# Altium schematic sheet 5_Band_Equalizer.SchDoc
size A; SheetNumber: 1; SheetTotal: 4
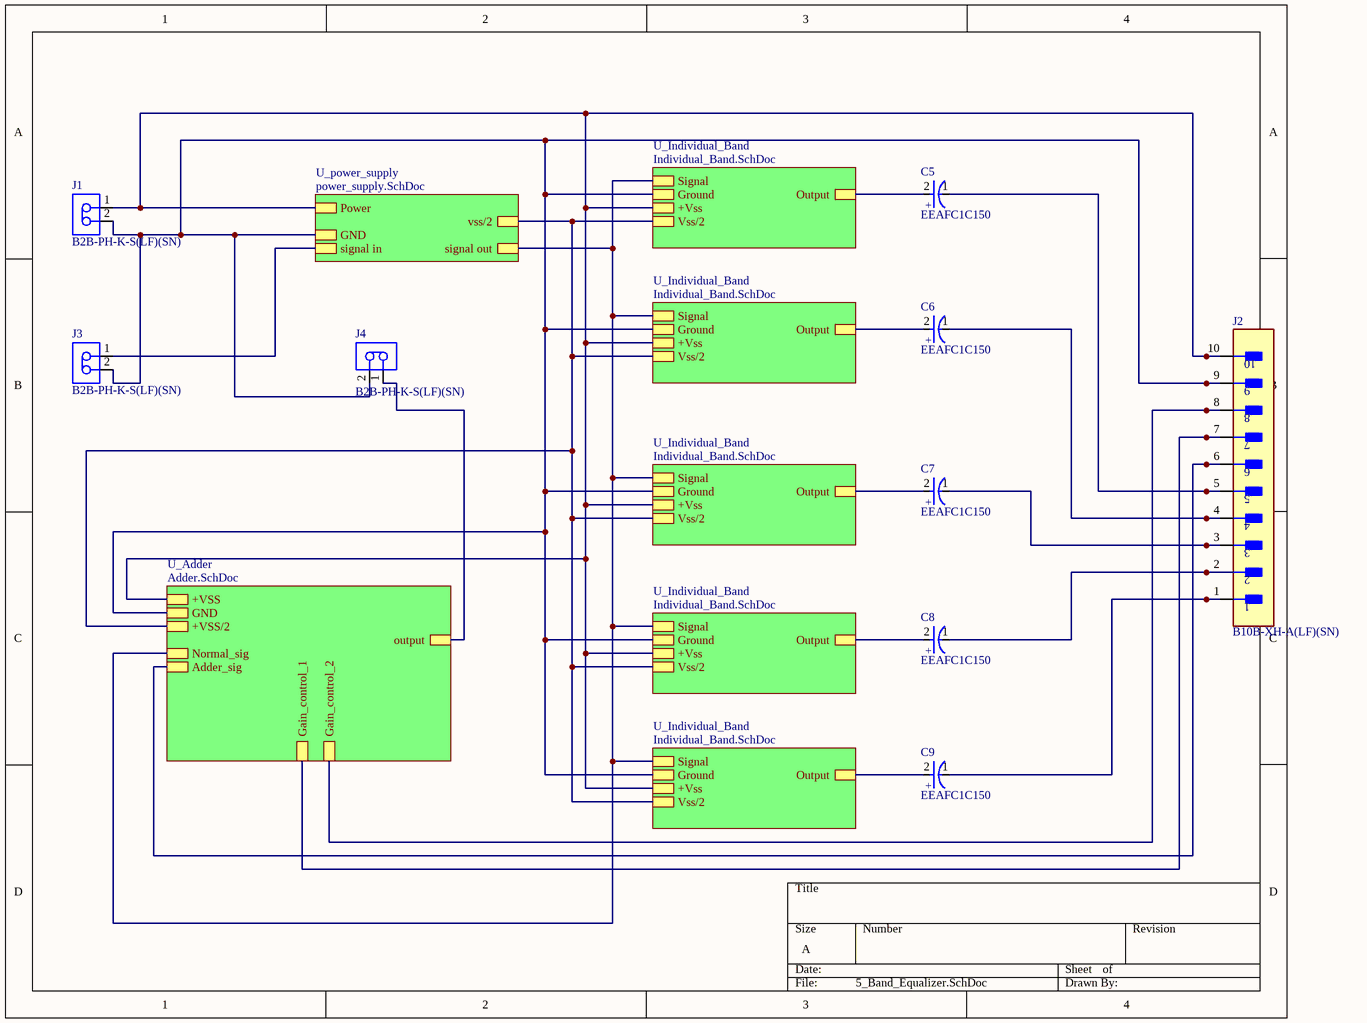
[diagram p0: 5_Band_Equalizer.SchDoc]

## Parts
C5  EEAFC1C150  [FP-RAD-TH-D_4_0_5-L_7_1-F-MFG]
C6  EEAFC1C150  [FP-RAD-TH-D_4_0_5-L_7_1-F-MFG]
C7  EEAFC1C150  [FP-RAD-TH-D_4_0_5-L_7_1-F-MFG]
C8  EEAFC1C150  [FP-RAD-TH-D_4_0_5-L_7_1-F-MFG]
C9  EEAFC1C150  [FP-RAD-TH-D_4_0_5-L_7_1-F-MFG]
J1  B2B-PH-K-S(LF)(SN)  [JST-B2B-PH-K-S_V]
J2  B10B-XH-A(LF)(SN)  [FP-B10B-XH-A_LF_SN-MFG]
J3  B2B-PH-K-S(LF)(SN)  [JST-B2B-PH-K-S_V]
J4  B2B-PH-K-S(LF)(SN)  [JST-B2B-PH-K-S_V]

## Sub-sheets
U_Adder = Adder.SchDoc: +VSS, GND, Gain_control_1, Gain_control_2, Normal_sig, Adder_sig, +VSS/2, output
U_Individual_Band = Individual_Band.SchDoc: Signal, Ground, +Vss, Vss/2, Output
U_Individual_Band = Individual_Band.SchDoc: Signal, Ground, +Vss, Vss/2, Output
U_Individual_Band = Individual_Band.SchDoc: Signal, Ground, +Vss, Vss/2, Output
U_Individual_Band = Individual_Band.SchDoc: Signal, Ground, +Vss, Vss/2, Output
U_Individual_Band = Individual_Band.SchDoc: Signal, Ground, +Vss, Vss/2, Output
U_power_supply = power_supply.SchDoc: GND, Power, vss/2, signal in, signal out

## Nets
NetC5_1: C5.1(C) J2.5
NetC5_2: C5.2(A) ; sheet U_Individual_Band/Output
NetC6_1: C6.1(C) J2.4
NetC6_2: C6.2(A) ; sheet U_Individual_Band/Output
NetC7_1: C7.1(C) J2.3
NetC7_2: C7.2(A) ; sheet U_Individual_Band/Output
NetC8_1: C8.1(C) J2.2
NetC8_2: C8.2(A) ; sheet U_Individual_Band/Output
NetC9_1: C9.1(C) J2.1
NetC9_2: C9.2(A) ; sheet U_Individual_Band/Output
NetJ1_1: J1.1 J2.10 ; sheet U_power_supply/Power, sheet U_Individual_Band/+Vss, sheet U_Individual_Band/+Vss, sheet U_Individual_Band/+Vss, sheet U_Individual_Band/+Vss, sheet U_Individual_Band/+Vss, sheet U_Adder/+VSS
NetJ1_2: J1.2 J2.9 J3.2 J4.2 ; sheet U_power_supply/GND, sheet U_Individual_Band/Ground, sheet U_Individual_Band/Ground, sheet U_Individual_Band/Ground, sheet U_Individual_Band/Ground, sheet U_Individual_Band/Ground, sheet U_Adder/GND
NetJ2_6: J2.6 ; sheet U_Adder/Adder_sig
NetJ2_7: J2.7 ; sheet U_Adder/Gain_control_1
NetJ2_8: J2.8 ; sheet U_Adder/Gain_control_2
NetJ3_1: J3.1 ; sheet U_power_supply/signal in
NetJ4_1: J4.1 ; sheet U_Adder/output
(unnamed): sheet U_power_supply/vss/2, sheet U_Individual_Band/Vss/2, sheet U_Individual_Band/Vss/2, sheet U_Individual_Band/Vss/2, sheet U_Individual_Band/Vss/2, sheet U_Individual_Band/Vss/2, sheet U_Adder/+VSS/2
(unnamed): sheet U_power_supply/signal out, sheet U_Individual_Band/Signal, sheet U_Individual_Band/Signal, sheet U_Individual_Band/Signal, sheet U_Individual_Band/Signal, sheet U_Individual_Band/Signal, sheet U_Adder/Normal_sig

## Notes on the sheet
- (in symbol CMP-05427-001559-1) +

## Library data of the parts
C5-C9 = CMP-05427-001559-1: Aluminum Electrolytic Capacitors (Radial Lead Type) AEC-Q200 Qualified 15uF ±20% 16V; Life (Hours): 1000Hour; Ripple Current: 65mA; ESR (Equivalent Series Resistance): 2R; Leakage Current: 3uA; Lead Diameter: 0.45mm; Construction: RADIAL; Mount: Through Hole; Voltage Rating: 16V; Radiation Hardening: No; Case/Package: Radial; Length: 7mm; Diameter: 4mm; Min Operating Temperature: -55°C; Voltage: 16V; Height - Seated (Max): 0.315inch; Voltage Rating (DC): 16V; Tolerance: 20%; Lead Pitch: 1.5mm; Height: 7mm; Impedance: 2R; Capacitance: 15uF; Termination: Radial; Packaging: Bulk; RoHS Compliant: Yes; Series: FC; Package Quantity: 200; Max Operating Temperature: 105°C
J1 J3 J4 = CMP-2000-05162-1: Male Header, Pitch 2 mm, 1 x 2 Position, Height 6 mm, Tail Length 3.4 mm, -25 to 85 degC, RoHS, Bulk; Manufacturer: JST; Pitch: 2mm; Style/Orientation: StraightHeader/Plug; No of Positions: 2; Datasheet Version: Nov-08; Datasheet URL: http://datasheet.octopart.com/B2B-PH-K-S%28LF%29%28SN%29-JST-datasheet-8324864.pdf; Manufacturer URL: http://www.jst.com/home2.html; Type: ShroudedHeader; Termination: Crimp
J2 = CMP-17439-000145-1: CONN HEADER VERT 10POS 2.5MM; Voltage Rating: 250V; Current Rating: 3A; Wire/Cable Gauge: 22AWG; Number of Contacts: 10; Contact Resistance: 20mR; Mated Stacking Heights: 9.8mm; Gender: Male; Insulation Resistance: 1GR; Series: XH; Max Current Rating: 3A; Contact Shape: Square; Contact Material: Brass; Housing Material: Polyamide; Lead Free: Lead Free; Orientation: Straight; Max Voltage Rating (DC): 250V; Contact Type: Male Pin; Number of Positions: 10; Length: 27.4mm; Housing Color: White; Max Voltage Rating (AC): 250V; Depth: 5.75mm; Mount: Through Hole; Pitch: 2.5mm; Fastening Type: Detent; Flammability Rating: UL94 V-0; Color: Natural; Contact Plating: Tin; Insulation Color: Natural; Packaging: Bulk; REACH SVHC: No SVHC; Insulation Material: Nylon; Connector Type: Header; Lead Pitch: 2.5mm; Contact Finish - Mating: TIN; Voltage Rating (AC): 250V; Number of Rows: 1; Max Operating Temperature: 85°C; Min Operating Temperature: -25°C; Termination: Solder